# Altium project Documents.PRJPCB
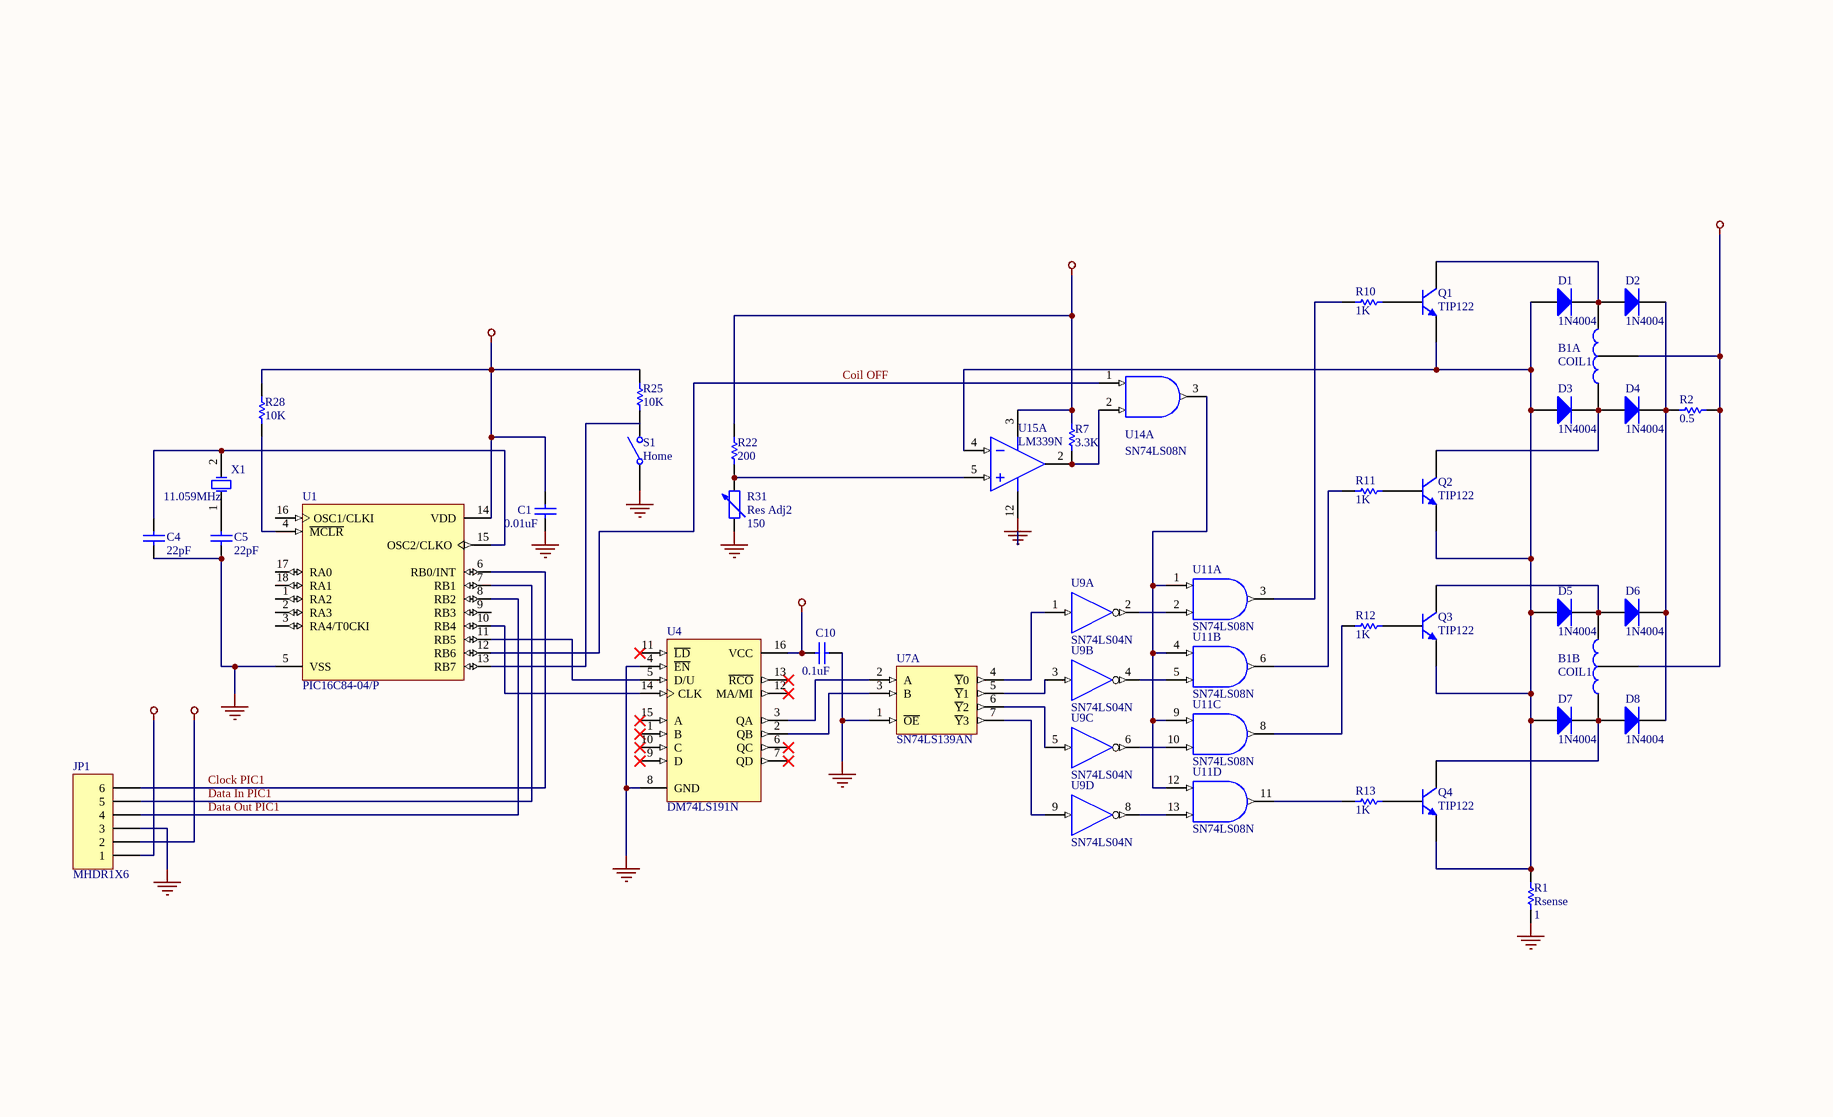
[diagram p0: Sheet1.SchDoc]
4 sheets, 178 parts. Net scope: global (net labels, ports and power ports of the same name join across sheets).
Board files: Board Sensor2.PcbDoc, Board Sensor - extra.PcbDoc, Driver4.PcbDoc, Board Sensor.PcbDoc, Picker.PcbDoc, adua.PcbDoc, Driver2.PcbDoc, Driver3.PcbDoc, Driver5.PcbDoc, main.PCBDOC
Sheets:
  Sheet1.SchDoc
  Driver3.SchDoc
  MAIN.SchDoc
  END EFFECTOR.SchDoc

## Sheet Sheet1.SchDoc: X-AXIS CONTROLLER CIRCUIT
size 342 x 208 mm; DrawnBy: Daniel C. Salunga; SheetNumber: 1

### Parts
(Parts that share a designator on the sheet are numbered #1, #2 ... from top to bottom, then left to right.)
B1A#1  COIL1
B1B#1  COIL1
C1#1  value 0.01uF  [DIP-18]  (hidden comment: PIC16C84-04/P)
C4#1  value 22pF  [BCY-W2/D3.1]  (hidden comment: XTAL)
C5#1  value 22pF  [BCY-W2/D3.1]  (hidden comment: XTAL)
C10#1  value 0.1uF  [DIP-14/D19.7]  (hidden comment: SN74LS08N)
D1#1  1N4004  [DIO10.46-5.3x2.8]
D2#1  1N4004  [DIO10.46-5.3x2.8]
D3#1  1N4004  [DIO10.46-5.3x2.8]
D4#1  1N4004  [DIO10.46-5.3x2.8]
D5#1  1N4004  [DIO10.46-5.3x2.8]
D6#1  1N4004  [DIO10.46-5.3x2.8]
D7#1  1N4004  [DIO10.46-5.3x2.8]
D8#1  1N4004  [DIO10.46-5.3x2.8]
JP1  MHDR1X6  [MHDR1X6]
Q1#1  TIP122  [SFM-T3/X1.6V]
Q2  TIP122  [SFM-T3/X1.6V]
Q3#1  TIP122  [SFM-T3/X1.6V]
Q4#1  TIP122  [SFM-T3/X1.6V]
R1#1  Rsense  value 1  [DIO10.46-5.3x2.8]
R2#1  value 0.5  [DIO10.46-5.3x2.8]  (hidden comment: 1N4004)
R7#1  value 3.3K  [BCY-W3]  (hidden comment: NPN3)
R10#1  1K  [AXIAL-0.3]
R11#1  value 1K  [BCY-W3]  (hidden comment: NPN3)
R12#1  value 1K  [BCY-W3]  (hidden comment: NPN3)
R13#1  value 1K  [BCY-W3]  (hidden comment: NPN3)
R22#1  value 200  [SO-G14/E2]  (hidden comment: DM74LS05M)
R25  value 10K  [SPST-2]  (hidden comment: SW-SPST)
R28#1  value 10K  [DIP-18]  (hidden comment: PIC16C84-04/P)
R31#1  Res Adj2  value 150  [AXIAL-0.6]
S1  Home  [SPST-2]
U1  PIC16C84-04/P  [DIP-18]
U4#1  DM74LS191N  [DIP-16]
U7#1  SN74LS139AN  [DIP-16/X1.5]  (part A of 2)
U9#1  SN74LS04N  [DIP-14/D19.7]  (parts A,B,C,D of 6)
U11#1  SN74LS08N  [DIP-14/D19.7]  (parts A,B,C,D of 4)
U14#1  SN74LS08N  [DIP-14/D19.7]  (part A of 4)
U15#1  LM339N  [DIP-14/D19.7]  (part A of 4)
X1#1  11.059MHz  [BCY-W2/D3.1]

### Nets
+12V: B1A#1.3(Supply) B1B#1.3(Supply) JP1.1 R2#1.2
GND: C1#1.1 C4#1.1 C5#1.1 C10#1.1 JP1.3 R1#1.2 R31#1.1 S1.1(COMMON) U1.5(VSS) U4#1.4(~{EN}) U4#1.8(GND) U7#1.1(~{OE}) U7#1.8(GND) U9#1.7(GND) U11#1.7(GND) U14#1.7(GND) U15#1.12(GND)
VCC: U7#1.16(VCC) U11#1.14(VCC) U14#1.14(VCC)
VDD: C1#1.2 C10#1.2 JP1.2 R7#1.2 R22#1.2 R25.2 R28#1.2 U1.14(VDD) U4#1.16(VCC) U9#1.14(VDD) U15#1.3(V+)
Clock PIC1: JP1.6 U1.6(RB0/INT)
Coil OFF: U1.12(RB6) U14#1.1(A)
Data In PIC1: JP1.5 U1.7(RB1)
Data Out PIC1: JP1.4 U1.8(RB2)
NetB1A#1_1: B1A#1.1 D3#1.2(K) D4#1.1(A) Q2.2(C)
NetB1A#1_2: B1A#1.2 D1#1.2(K) D2#1.1(A) Q1#1.2(C)
NetB1B#1_1: B1B#1.1 D1#1.1(A) D3#1.1(A) D5#1.1(A) D7#1.1(A) D7#1.2(K) D8#1.1(A) Q1#1.3(E) Q2.3(E) Q3#1.3(E) Q4#1.2(C) Q4#1.3(E) R1#1.1 U15#1.4(IN-)
NetB1B#1_2: B1B#1.2 D5#1.2(K) D6#1.1(A) Q3#1.2(C)
NetC4#1_2: C4#1.2 U1.15(OSC2/CLKO) X1#1.2(OSC2)
NetC5#1_2: C5#1.2 X1#1.1(OSC1)
NetD2#1_2: D2#1.2(K) D4#1.2(K) D6#1.2(K) D8#1.2(K) R2#1.1
NetQ1#1_1: Q1#1.1(B) R10#1.2
NetQ2_1: Q2.1(B) R11#1.2
NetQ3#1_1: Q3#1.1(B) R12#1.2
NetQ4#1_1: Q4#1.1(B) R13#1.1
NetR7#1_1: R7#1.1 U14#1.2(B) U15#1.2(OUT)
NetR10#1_1: R10#1.1 U11#1.3(Y)
NetR11#1_1: R11#1.1 U11#1.6(Y)
NetR12#1_1: R12#1.1 U11#1.8(Y)
NetR13#1_2: R13#1.2 U11#1.11(Y)
NetR22#1_1: R22#1.1 R31#1.2 U15#1.5(IN+)
NetR25_1: R25.1 U1.13(RB7)
NetR28#1_1: R28#1.1 U1.4(~{MCLR})
NetU1_10: U1.10(RB4) U4#1.14(CLK)
NetU1_11: U1.11(RB5) U4#1.5(D/U)
NetU4#1_2: U4#1.2(QB) U7#1.3(B)
NetU4#1_3: U4#1.3(QA) U7#1.2(A)
NetU7#1_4: U7#1.4(~{Y}0) U9#1.1(IN)
NetU7#1_5: U7#1.5(~{Y}1) U9#1.3(IN)
NetU7#1_6: U7#1.6(~{Y}2) U9#1.5(IN)
NetU7#1_7: U7#1.7(~{Y}3) U9#1.9(IN)
NetU9#1_2: U9#1.2(~{OUT}) U11#1.2(B)
NetU9#1_4: U9#1.4(~{OUT}) U11#1.5(B)
NetU9#1_6: U9#1.6(~{OUT}) U11#1.10(B)
NetU9#1_8: U9#1.8(~{OUT}) U11#1.13(B)
NetU11#1_1: U11#1.1(A) U11#1.4(A) U11#1.9(A) U11#1.12(A) U14#1.3(Y)

Not connected (* = marked no-connect by the designer): S1 2(NO); U1 1(RA2) 2(RA3) 3(RA4/T0CKI) 9(RB3) 16(OSC1/CLKI) 17(RA0) 18(RA1); U4#1 1(B)* 6(QC)* 7(QD)* 9(D)* 10(C)* 11(~{LD})* 12(MA/MI)* 13(~{RCO})* 15(A)*

### Library data of the parts
B1A#1 B1B#1 = Component_1
C1#1 C4#1 C5#1 C10#1 = cap: Capacitor; Manufacturer: Generic Components; Class I: Passive; Published: 8-Jun-2000; Revision: July-2002: Re-released for DXP Platform.; Publisher: Altium Limited; Class II: Capacitor
D1#1 D2#1 D3#1 D4#1 D5#1 D6#1 D7#1 D8#1 = 1N4004: 1.0 Ampere General Purpose Rectifier; Manufacturer: Fairchild Semiconductor; Revision 1: 11-July-2000: SIM Model Added.; Revision 2: July-2002: Re-released for DXP Platform.; Package Information: Latest Revision: Aug-1999; Class I: Discrete; Class II: Rectifier - Standard Recovery; Published: 8-Jun-2000; Datasheet: Latest Revision: 1998; Package Reference: DO-41; Publisher: Altium Limited
JP1 = MHDR1X6: Header, 6-Pin; Manufacturer: Generic Components; Class I: Connector; Revision: July-2002: Re-released for DXP Platform.; Publisher: Altium Limited
Q1#1 Q2 Q3#1 Q4#1 = MJE15030: Complementary Silicon Plastic Power Transistor; Manufacturer: Motorola; Package Information: Latest Revision: 1997; Class I: Discrete; Class II: BJT - Medium Power; Note: Pin 2 is electrically connected to Pin 4 (TAB); Published: 29-Sep-2000; Revision: July-2002: Re-released for DXP Platform.; Datasheet: Latest Revision: 1995; Package Reference: 221A-06; Publisher: Altium Limited
R1#1 R2#1 R7#1 R11#1 R12#1 R13#1 R22#1 R25 R28#1 = res1: Resistor; Manufacturer: Generic Components; Class I: Passive; Published: 8-Jun-2000; Revision: July-2002: Re-released for DXP Platform.; Publisher: Altium Limited; Class II: Resistor
R10#1 = Res1: Resistor; Manufacturer: Generic Components; Class I: Passive; Published: 8-Jun-2000; Publisher: Altium Limited; Class II: Resistor; Revision: July-2002: Re-released for DXP Platform.; Value: 1K
R31#1 = Res Adj2: Variable Resistor; Manufacturer: Generic Components; Class I: Passive; Set Position: 0.5; Published: 8-Jun-2000; Revision: July-2002: Re-released for DXP Platform.; Publisher: Altium Limited; Class II: Resistor
S1 = SW-SPST: Single-Pole, Single-Throw Switch; Manufacturer: Generic Components; Published: 24-Mar-1999; Revision: July-2002: Re-released for DXP Platform.; Publisher: Altium Limited
U1 = PIC16C84-04/P: EPROM-Based 8-Bit CMOS Microcontroller; Manufacturer: Microchip; Published: 8-Jun-2000; Revision: July-2002: Re-released for DXP Platform.; Datasheet: 1997 Technical Library CD (1996); Package Reference: P18A; Publisher: Altium Limited; Class I: Microcontroller; Class II: 8-bit
U4#1 = DM74LS191N: Synchronous 4-Bit Up/Down Counter with Mode Control; Manufacturer: National Semiconductor; Class I: Logic; Published: 15-Apr-2002; Datasheet: Latest Revision: May-1989; Package Reference: N16E; Publisher: Altium Limited; Class II: Counter
U7#1 = SN74LS139AN: Dual 2-Line to 4-Line Decoder / Demultiplexer; Manufacturer: Texas Instruments; Revision 1: 12-July-2000: SIM Model Added.; Revision 2: July-2002: Re-released for DXP Platform.; Class I: Logic; Published: 8-Jun-2000; Datasheet: Latest Revision: Mar-1988; Package Reference: N016; Publisher: Altium Limited; Class II: Decoder/Demultiplexer
U9#1 = SN74LS04N: Hex Inverter; Manufacturer: ON Semiconductor; Class I: Logic; Class II: Buffer/Line Driver; Published: 15-Apr-2002; Datasheet: Latest Revision: 1999; Package Reference: 646-06; Publisher: Altium Limited
U11#1 U14#1 = SN74LS08N: Quadruple 2-Input Positive-AND Gate; Manufacturer: Texas Instruments; Class I: Logic; Published: 8-Jun-2000; Revision: July-2002: Re-released for DXP Platform.; Datasheet: Latest Revision: Mar-1988; Package Reference: N014; Publisher: Altium Limited; Class II: Gate
U15#1 = LM339N: Quad Single-Supply Comparator; Manufacturer: Motorola; Class I: Analog; Published: 15-Apr-2002; Datasheet: Linear and Interface Integrated Circuits, DL128 Rev2 (1988); Package Reference: 646-06; Publisher: Altium Limited; Class II: Comparator
X1#1 = XTAL: Crystal Oscillator; Manufacturer: Generic Components; Published: 8-Jun-2000; Revision: July-2002: Re-released for DXP Platform.; Publisher: Altium Limited; Class I: Oscillator; Class II: Crystal Oscillator

## Sheet Driver3.SchDoc
size B
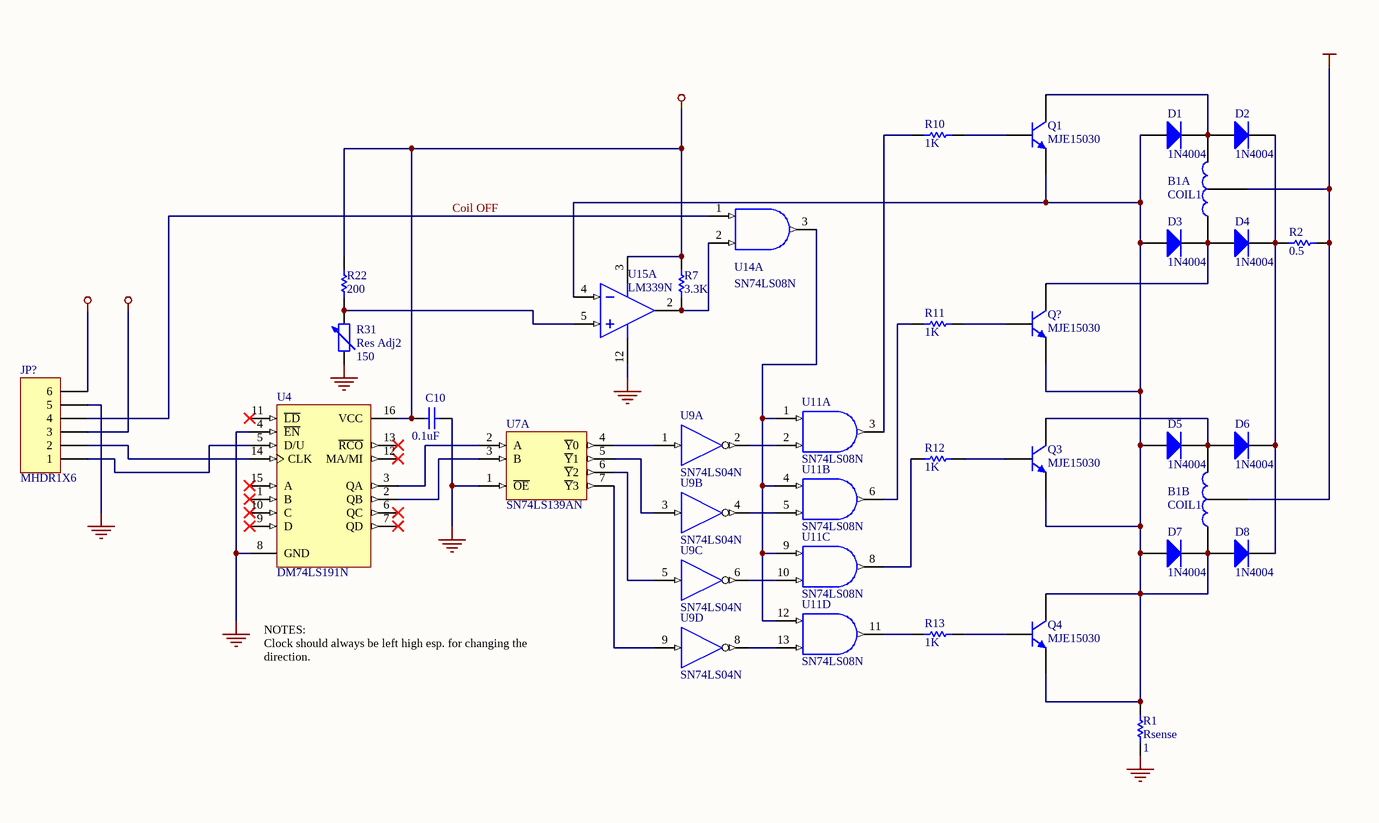
[diagram p1: Driver3.SchDoc]

### Parts
(Parts that share a designator on the sheet are numbered #1, #2 ... from top to bottom, then left to right.)
B1A#2  COIL1
B1B#2  COIL1
C10#2  value 0.1uF  [DIP-14/D19.7]  (hidden comment: SN74LS08N)
D1#2  1N4004  [DIO10.46-5.3x2.8]
D2#2  1N4004  [DIO10.46-5.3x2.8]
D3#2  1N4004  [DIO10.46-5.3x2.8]
D4#2  1N4004  [DIO10.46-5.3x2.8]
D5#2  1N4004  [DIO10.46-5.3x2.8]
D6#2  1N4004  [DIO10.46-5.3x2.8]
D7#2  1N4004  [DIO10.46-5.3x2.8]
D8#2  1N4004  [DIO10.46-5.3x2.8]
JP?#1  MHDR1X6  [MHDR1X6]
Q1#2  MJE15030  [SFM-T3/X1.6V]
Q3#2  MJE15030  [SFM-T3/X1.6V]
Q4#2  MJE15030  [SFM-T3/X1.6V]
Q?#1  MJE15030  [SFM-T3/X1.6V]
R1#2  Rsense  value 1  [DIO10.46-5.3x2.8]
R2#2  value 0.5  [DIO10.46-5.3x2.8]  (hidden comment: 1N4004)
R7#2  value 3.3K  [BCY-W3]  (hidden comment: NPN3)
R10#2  1K  [AXIAL-0.3]
R11#2  value 1K  [BCY-W3]  (hidden comment: NPN3)
R12#2  value 1K  [BCY-W3]  (hidden comment: NPN3)
R13#2  value 1K  [BCY-W3]  (hidden comment: NPN3)
R22#2  value 200  [SO-G14/E2]  (hidden comment: DM74LS05M)
R31#2  Res Adj2  value 150  [AXIAL-0.6]
U4#2  DM74LS191N  [DIP-16]
U7#2  SN74LS139AN  [DIP-16/X1.5]  (part A of 2)
U9#2  SN74LS04N  [DIP-14/D19.7]  (parts A,B,C,D of 6)
U11#2  SN74LS08N  [DIP-14/D19.7]  (parts A,B,C,D of 4)
U14#2  SN74LS08N  [DIP-14/D19.7]  (part A of 4)
U15#2  LM339N  [DIP-14/D19.7]  (part A of 4)

### Nets
+12V: B1A#2.3(Supply) B1B#2.3(Supply) JP?#1.6 R2#2.2
GND: C10#2.1 JP?#1.5 R1#2.2 R31#2.1 U4#2.4(~{EN}) U4#2.8(GND) U7#2.1(~{OE}) U7#2.8(GND) U9#2.7(GND) U11#2.7(GND) U14#2.7(GND) U15#2.12(GND)
VCC: U7#2.16(VCC) U11#2.14(VCC) U14#2.14(VCC)
VDD: C10#2.2 JP?#1.3 R7#2.2 R22#2.2 U4#2.16(VCC) U9#2.14(VDD) U15#2.3(V+)
Coil OFF: JP?#1.4 U14#2.1(A)
NetB1A#2_1: B1A#2.1 D3#2.2(K) D4#2.1(A) Q?#1.2(C)
NetB1A#2_2: B1A#2.2 D1#2.2(K) D2#2.1(A) Q1#2.2(C)
NetB1B#2_1: B1B#2.1 D1#2.1(A) D3#2.1(A) D5#2.1(A) D7#2.1(A) D7#2.2(K) D8#2.1(A) Q1#2.3(E) Q3#2.3(E) Q4#2.2(C) Q4#2.3(E) Q?#1.3(E) R1#2.1 U15#2.4(IN-)
NetB1B#2_2: B1B#2.2 D5#2.2(K) D6#2.1(A) Q3#2.2(C)
NetD2#2_2: D2#2.2(K) D4#2.2(K) D6#2.2(K) D8#2.2(K) R2#2.1
NetJP?#1_1: JP?#1.1 U4#2.5(D/U)
NetJP?#1_2: JP?#1.2 U4#2.14(CLK)
NetQ1#2_1: Q1#2.1(B) R10#2.2
NetQ3#2_1: Q3#2.1(B) R12#2.2
NetQ4#2_1: Q4#2.1(B) R13#2.1
NetQ?#1_1: Q?#1.1(B) R11#2.2
NetR7#2_1: R7#2.1 U14#2.2(B) U15#2.2(OUT)
NetR10#2_1: R10#2.1 U11#2.3(Y)
NetR11#2_1: R11#2.1 U11#2.6(Y)
NetR12#2_1: R12#2.1 U11#2.8(Y)
NetR13#2_2: R13#2.2 U11#2.11(Y)
NetR22#2_1: R22#2.1 R31#2.2 U15#2.5(IN+)
NetU4#2_2: U4#2.2(QB) U7#2.3(B)
NetU4#2_3: U4#2.3(QA) U7#2.2(A)
NetU7#2_4: U7#2.4(~{Y}0) U9#2.1(IN)
NetU7#2_5: U7#2.5(~{Y}1) U9#2.3(IN)
NetU7#2_6: U7#2.6(~{Y}2) U9#2.5(IN)
NetU7#2_7: U7#2.7(~{Y}3) U9#2.9(IN)
NetU9#2_2: U9#2.2(~{OUT}) U11#2.2(B)
NetU9#2_4: U9#2.4(~{OUT}) U11#2.5(B)
NetU9#2_6: U9#2.6(~{OUT}) U11#2.10(B)
NetU9#2_8: U9#2.8(~{OUT}) U11#2.13(B)
NetU11#2_1: U11#2.1(A) U11#2.4(A) U11#2.9(A) U11#2.12(A) U14#2.3(Y)

Not connected (* = marked no-connect by the designer): U4#2 1(B)* 6(QC)* 7(QD)* 9(D)* 10(C)* 11(~{LD})* 12(MA/MI)* 13(~{RCO})* 15(A)*

### Notes on the sheet
- NOTES:
  Clock should always be left high esp. for changing the direction.

### Library data of the parts
B1A#2 B1B#2 = Component_1
C10#2 = cap: as C1#1 on sheet Sheet1; Published: 8-Jun-2000; Revision: July-2002: Re-released for DXP Platform.; Publisher: Altium Limited; Class II: Capacitor
D1#2 D2#2 D3#2 D4#2 D5#2 D6#2 D7#2 D8#2 = 1N4004: as D1#1 on sheet Sheet1; Published: 8-Jun-2000; Datasheet: Latest Revision: 1998; Package Reference: DO-41; Publisher: Altium Limited
JP?#1 = MHDR1X6: as JP1 on sheet Sheet1; Revision: July-2002: Re-released for DXP Platform.; Publisher: Altium Limited
Q1#2 Q3#2 Q4#2 Q?#1 = MJE15030: as Q1#1 on sheet Sheet1; Published: 29-Sep-2000; Revision: July-2002: Re-released for DXP Platform.; Datasheet: Latest Revision: 1995; Package Reference: 221A-06; Publisher: Altium Limited
R1#2 R2#2 R7#2 R11#2 R12#2 R13#2 R22#2 = res1: as R1#1 on sheet Sheet1; Published: 8-Jun-2000; Revision: July-2002: Re-released for DXP Platform.; Publisher: Altium Limited; Class II: Resistor
R10#2 = Res1: as R10#1 on sheet Sheet1; Published: 8-Jun-2000; Publisher: Altium Limited; Class II: Resistor; Revision: July-2002: Re-released for DXP Platform.; Value: 1K
R31#2 = Res Adj2: as R31#1 on sheet Sheet1; Published: 8-Jun-2000; Revision: July-2002: Re-released for DXP Platform.; Publisher: Altium Limited; Class II: Resistor
U4#2 = DM74LS191N: as U4#1 on sheet Sheet1; Published: 15-Apr-2002; Datasheet: Latest Revision: May-1989; Package Reference: N16E; Publisher: Altium Limited; Class II: Counter
U7#2 = SN74LS139AN: as U7#1 on sheet Sheet1; Published: 8-Jun-2000; Datasheet: Latest Revision: Mar-1988; Package Reference: N016; Publisher: Altium Limited; Class II: Decoder/Demultiplexer
U9#2 = SN74LS04N: as U9#1 on sheet Sheet1; Published: 15-Apr-2002; Datasheet: Latest Revision: 1999; Package Reference: 646-06; Publisher: Altium Limited
U11#2 U14#2 = SN74LS08N: as U11#1 on sheet Sheet1; Published: 8-Jun-2000; Revision: July-2002: Re-released for DXP Platform.; Datasheet: Latest Revision: Mar-1988; Package Reference: N014; Publisher: Altium Limited; Class II: Gate
U15#2 = LM339N: as U15#1 on sheet Sheet1; Published: 15-Apr-2002; Datasheet: Linear and Interface Integrated Circuits, DL128 Rev2 (1988); Package Reference: 646-06; Publisher: Altium Limited; Class II: Comparator

## Sheet MAIN.SchDoc
size OrCAD C
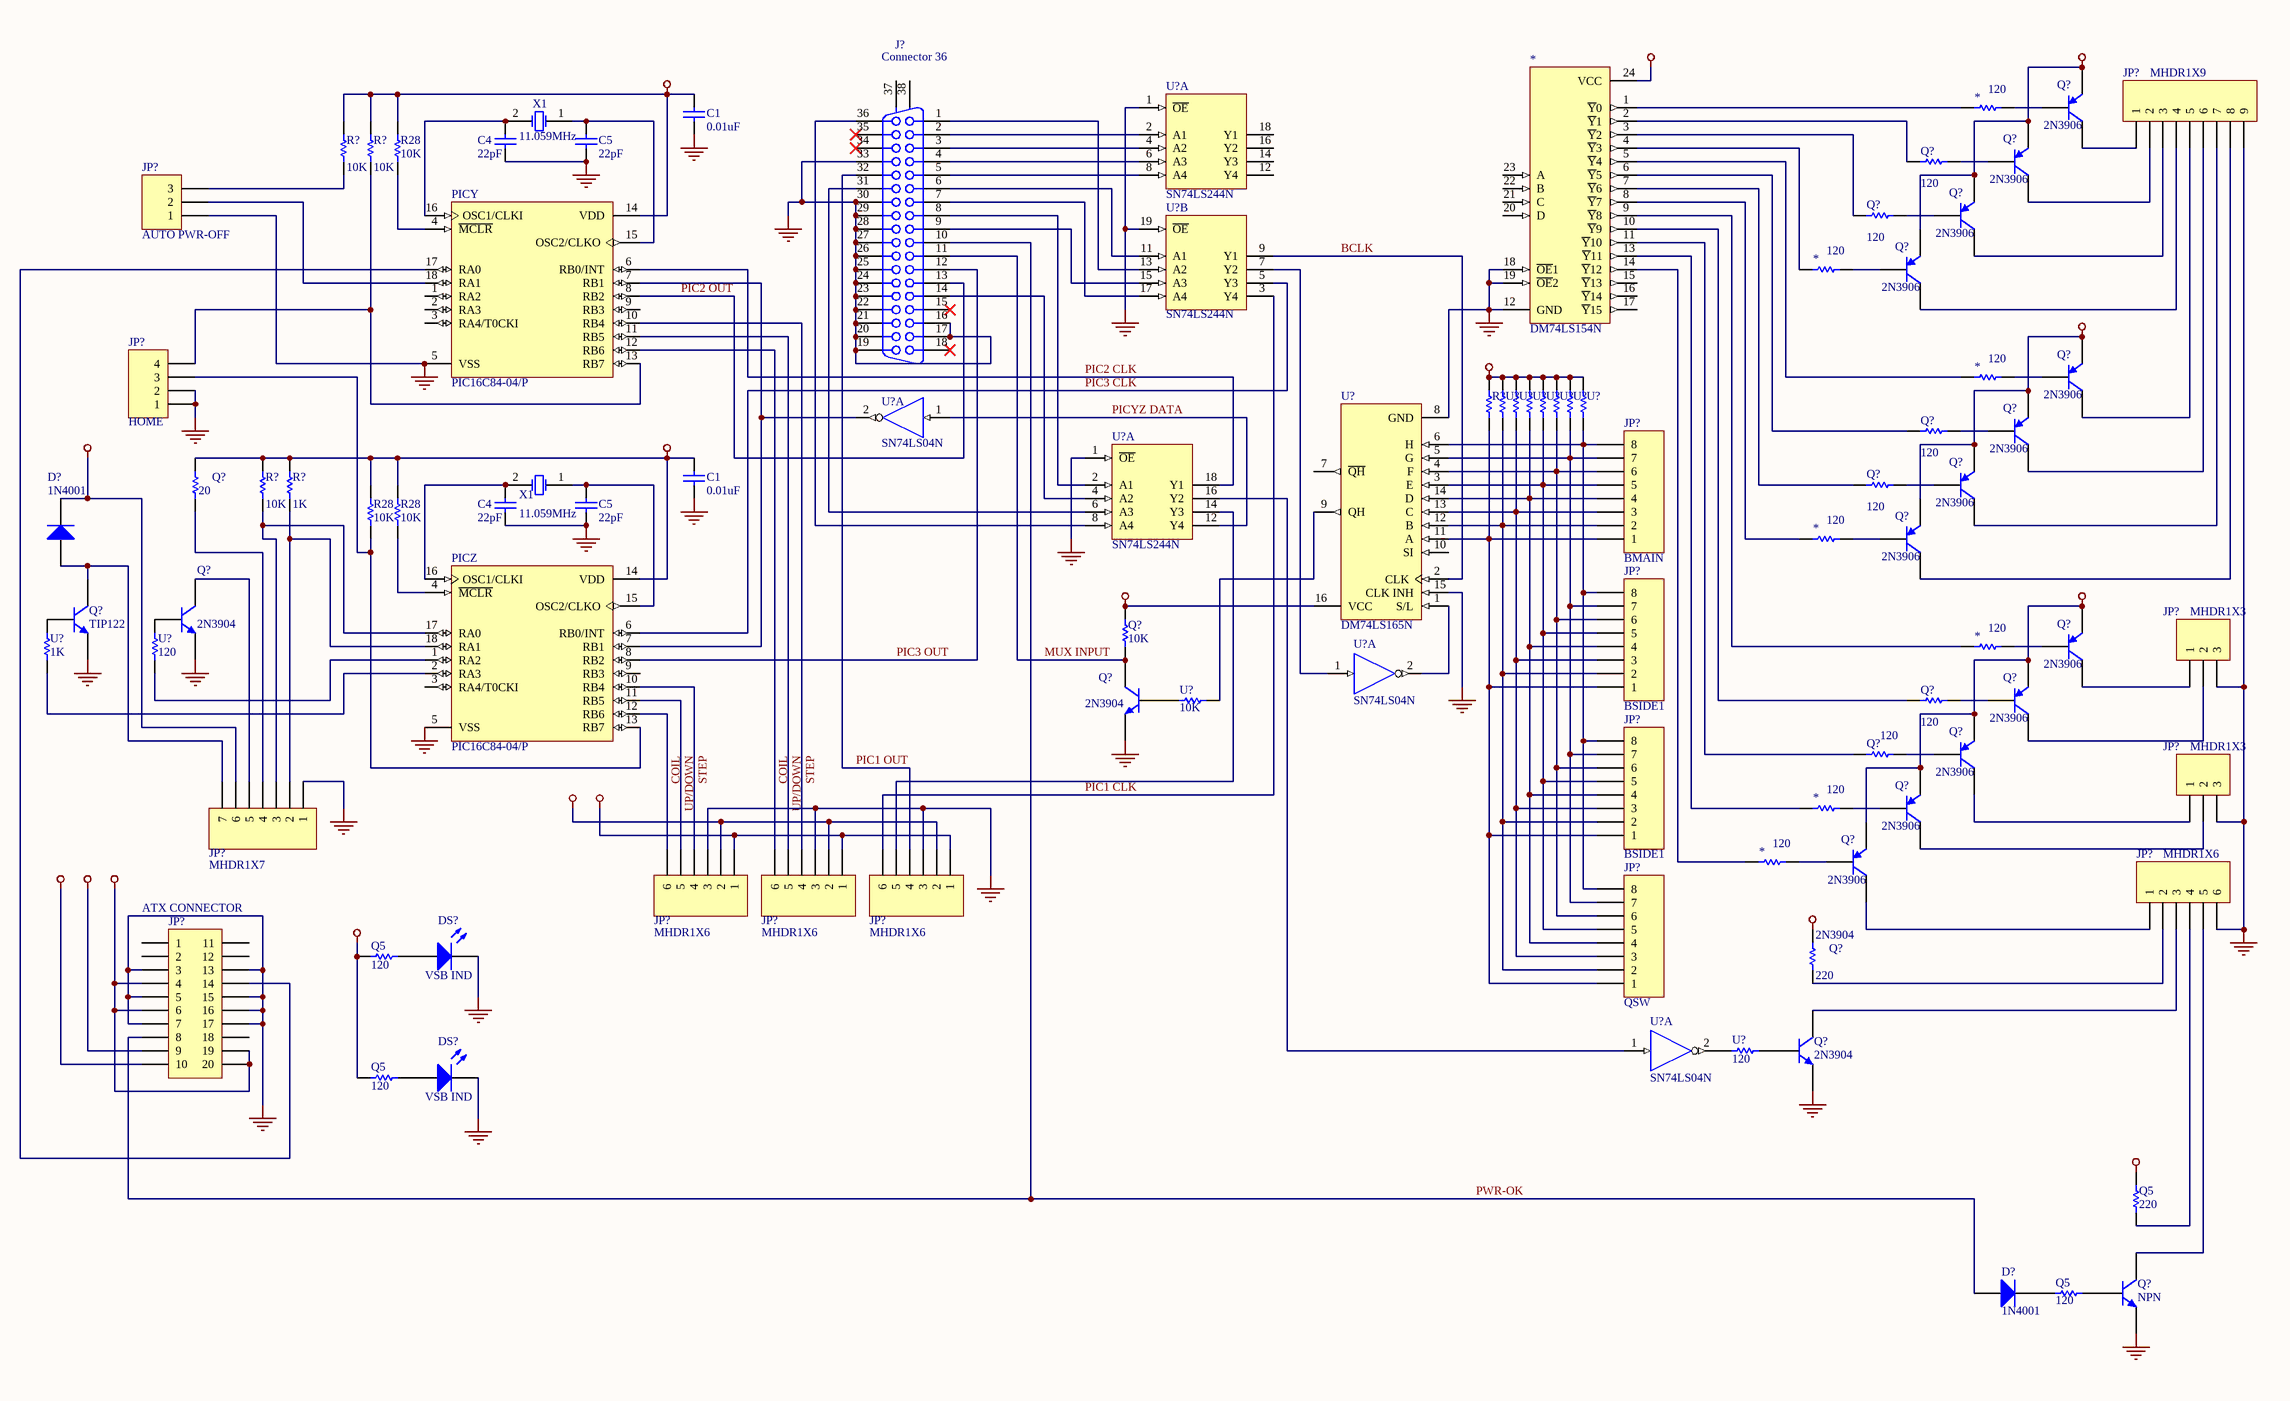
[diagram p2: MAIN.SchDoc]

### Parts
(Parts that share a designator on the sheet are numbered #1, #2 ... from top to bottom, then left to right.)
*#1  DM74LS154N  [DIP-16/X1.5]
*#2  value 120  [DIP-16/X1.5]  (hidden comment: SN74LS161AN)
*#3  value 120  [DIP-16/X1.5]  (hidden comment: SN74LS161AN)
*#4  value 120  [DIP-16/X1.5]  (hidden comment: SN74LS161AN)
*#5  value 120  [DIP-16/X1.5]  (hidden comment: SN74LS161AN)
*#6  value 120  [DIP-16/X1.5]  (hidden comment: SN74LS161AN)
*#7  value 120  [DIP-16/X1.5]  (hidden comment: SN74LS161AN)
*#8  value 120  [DIP-16/X1.5]  (hidden comment: SN74LS161AN)
C1#2  value 0.01uF  [RAD-0.3]
C1#3  value 0.01uF  [RAD-0.3]
C4#2  value 22pF  [C3216-1206]  (hidden comment: XTAL)
C4#3  value 22pF  [C3216-1206]  (hidden comment: XTAL)
C5#2  value 22pF  [C3216-1206]  (hidden comment: XTAL)
C5#3  value 22pF  [C3216-1206]  (hidden comment: XTAL)
D?#1  1N4001  [DIO10.46-5.3x2.8]
D?#2  1N4001  [DIO10.46-5.3x2.8]
DS?#1  VSB IND  [DSO-F2/D6.1]
DS?#2  VSB IND  [DSO-F2/D6.1]
J?  Connector 36  [CHAMP1.27-2H36]
JP?#2  MHDR1X9  [MHDR1X9]
JP?#3  AUTO PWR-OFF  [HDR1X3H]
JP?#4  HOME  [MHDR1X4]
JP?#5  BMAIN  [MHDR1X8]
JP?#6  MHDR1X3  [MHDR1X3]
JP?#7  BSIDE1  [MHDR1X8]
JP?#8  MHDR1X3  [MHDR1X3]
JP?#9  MHDR1X7  [MHDR1X7]
JP?#10  BSIDE1  [MHDR1X8]
JP?#11  MHDR1X6  [MHDR1X6]
JP?#12  MHDR1X6  [MHDR1X6]
JP?#13  MHDR1X6  [MHDR1X6]
JP?#14  MHDR1X6  [MHDR1X6]
JP?#15  ATX CONNECTOR  [HDR2X10_CEN]
JP?#16  QSW  [MHDR1X8]
PICY  PIC16C84-04/P  [DIP-18]
PICZ  PIC16C84-04/P  [DIP-18]
Q5#1  value 120  [SFM-T3/X1.6V]  (hidden comment: MJE15030)
Q5#2  value 120  [SFM-T3/X1.6V]  (hidden comment: MJE15030)
Q5#3  value 220  [SFM-T3/X1.6V]  (hidden comment: MJE15030)
Q5#4  value 120  [SFM-T3/X1.6V]  (hidden comment: MJE15030)
Q?#2  2N3906  [BCY-W3/D4.7]
Q?#3  value 120  [BCY-W3/D4.7]  (hidden comment: 2N3906)
Q?#4  2N3906  [BCY-W3/D4.7]
Q?#5  value 120  [BCY-W3/D4.7]  (hidden comment: 2N3906)
Q?#6  2N3906  [BCY-W3/D4.7]
Q?#7  2N3906  [BCY-W3/D4.7]
Q?#8  2N3906  [BCY-W3/D4.7]
Q?#9  value 120  [BCY-W3/D4.7]  (hidden comment: 2N3906)
Q?#10  2N3906  [BCY-W3/D4.7]
Q?#11  value 120  [BCY-W3/D4.7]  (hidden comment: 2N3906)
Q?#12  2N3906  [BCY-W3/D4.7]
Q?#13  value 20  [BCY-W3/D4.7]  (hidden comment: 2N3904)
Q?#14  2N3906  [BCY-W3/D4.7]
Q?#15  TIP122  [SFM-T3/X1.6V]
Q?#16  2N3904  [BCY-W3/D4.7]
Q?#17  2N3906  [BCY-W3/D4.7]
Q?#18  value 10K  [BCY-W3/D4.7]  (hidden comment: 2N3904)
Q?#19  2N3904  [BCY-W3/D4.7]
Q?#20  value 120  [BCY-W3/D4.7]  (hidden comment: 2N3906)
Q?#21  2N3906  [BCY-W3/D4.7]
Q?#22  value 120  [BCY-W3/D4.7]  (hidden comment: 2N3906)
Q?#23  2N3906  [BCY-W3/D4.7]
Q?#24  2N3906  [BCY-W3/D4.7]
Q?#25  2N3906  [BCY-W3/D4.7]
Q?#26  2N3904  value 220  [BCY-W3/D4.7]
Q?#27  2N3904  [BCY-W3/D4.7]
Q?#28  NPN  [BCY-W3]
R28#2  value 10K  [DIP-18]  (hidden comment: PIC16C84-04/P)
R28#3  value 10K  [DIP-18]  (hidden comment: PIC16C84-04/P)
R28#4  value 10K  [DIP-18]  (hidden comment: PIC16C84-04/P)
R?#1  value 10K  [AXIAL-0.7]  (hidden comment: Res Adj1)
R?#2  value 10K  [AXIAL-0.7]  (hidden comment: Res Adj1)
R?#3  10K  [SIP-P3]  (value not drawn)
R?#4  value 1K  [AXIAL-0.7]  (hidden comment: Res Adj1)
R?#5  value 10K  [AXIAL-0.7]  (hidden comment: Res Adj1)
U?#1  SN74LS244N  [DIP-20/E5.3]  (part A of 2)
U?#2  SN74LS244N  [DIP-20/E5.3]  (part B of 2)
U?#3  A3189SU  [SIP-P3]  (value not drawn)
U?#4  A3189SU  [SIP-P3]  (value not drawn)
U?#5  A3189SU  [SIP-P3]  (value not drawn)
U?#6  A3189SU  [SIP-P3]  (value not drawn)
U?#7  A3189SU  [SIP-P3]  (value not drawn)
U?#8  A3189SU  [SIP-P3]  (value not drawn)
U?#9  A3189SU  [SIP-P3]  (value not drawn)
U?#10  SN74LS04N  [DIP-14/D19.7]  (part A of 6)
U?#11  SN74LS244N  [DIP-20/E5.3]  (part A of 2)
U?#12  DM74LS165N  [CDFP-G16/E7]
U?#13  SN74LS04N  [DIP-14/D19.7]  (part A of 6)
U?#14  value 1K  [DIP-14/D19.7]  (hidden comment: SN74LS04N)
U?#15  value 120  [DIP-14/D19.7]  (hidden comment: SN74LS04N)
U?#16  value 10K  [CDFP-G16/E7]  (hidden comment: DM74LS165N)
U?#17  SN74LS04N  [DIP-14/D19.7]  (part A of 6)
U?#18  value 120  [DIP-14/D19.7]  (hidden comment: SN74LS04N)
X1#2  11.059MHz  [BCY-W2/D3.1]
X1#3  11.059MHz  [BCY-W2/D3.1]

### Nets
+12V: D?#1.2(K) JP?#9.6 JP?#11.1 JP?#12.1 JP?#13.1 JP?#15.10
GND: *#1.12(GND) *#1.18(~{OE}1) *#1.19(~{OE}2) C1#2.2 C1#3.2 C4#2.1 C4#3.1 C5#2.1 C5#3.1 DS?#1.2(K) DS?#2.2(K) J?.16 J?.17 J?.19 J?.20 J?.21 J?.22 J?.23 J?.24 J?.25 J?.26 J?.27 J?.28 J?.29 J?.30 J?.33 JP?#2.9 JP?#3.1 JP?#4.1 JP?#4.2 JP?#6.3 JP?#8.3 JP?#9.1 JP?#11.3 JP?#12.3 JP?#13.3 JP?#14.6 JP?#15.3 JP?#15.5 JP?#15.7 JP?#15.13 JP?#15.15 JP?#15.16 JP?#15.17 PICY.5(VSS) PICZ.5(VSS) Q?#15.3(E) Q?#16.1(E) Q?#19.1(E) Q?#27.1(E) Q?#28.3(E) U?#1.1(~{OE}) U?#1.10(GND) U?#2.10(GND) U?#2.19(~{OE}) U?#10.7(GND) U?#11.1(~{OE}) U?#11.10(GND) U?#12.8(GND) U?#12.15(CLK_INH) U?#13.7(GND) U?#17.7(GND)
VDD: *#1.24(VCC) C1#3.1 JP?#11.2 JP?#12.2 JP?#13.2 JP?#15.4 JP?#15.6 JP?#15.19 JP?#15.20 PICZ.14(VDD) Q?#2.1(E) Q?#4.1(E) Q?#6.1(E) Q?#7.1(E) Q?#8.1(E) Q?#10.1(E) Q?#12.1(E) Q?#13.2 Q?#14.1(E) Q?#17.1(E) Q?#18.2 Q?#21.1(E) Q?#23.1(E) Q?#24.1(E) Q?#25.1(E) Q?#26.2 R28#3.2 R28#4.2 R?#3.2 R?#4.1 R?#5.2 U?#1.20(VDD) U?#2.20(VDD) U?#3.2 U?#4.2 U?#5.2 U?#6.2 U?#7.2 U?#8.2 U?#9.2 U?#10.14(VDD) U?#11.20(VDD) U?#12.16(VCC) U?#13.14(VDD) U?#17.14(VDD)
VSB: C1#2.1 JP?#15.9 PICY.14(VDD) Q5#1.1 Q5#2.1 Q5#3.1 R28#2.2 R?#1.1 R?#2.1
BCLK: U?#2.9(Y1) U?#12.2(CLK)
COIL: JP?#11.6 JP?#12.6 PICY.12(RB6) PICZ.12(RB6)
MUX INPUT: J?.11 Q?#18.1 Q?#19.3(C)
PIC1 CLK: JP?#13.6 U?#2.3(Y4)
PIC1 OUT: J?.32 JP?#13.4
PIC2 CLK: PICY.6(RB0/INT) U?#11.18(Y1)
PIC2 OUT: J?.13 PICY.8(RB2)
PIC3 CLK: PICZ.6(RB0/INT) U?#2.5(Y3)
PIC3 OUT: J?.12 PICZ.8(RB2)
PICYZ DATA: U?#10.1(IN) U?#11.12(Y4)
PWR-OK: D?#2.1(A) J?.10 JP?#15.8
STEP: JP?#11.4 JP?#12.4 PICY.10(RB4) PICZ.10(RB4)
UP/DOWN: JP?#11.5 JP?#12.5 PICY.11(RB5) PICZ.11(RB5)
Net*#1_1: *#1.1(~{Y}0) *#2.1
Net*#1_2: *#1.2(~{Y}1) Q?#3.1
Net*#1_3: *#1.3(~{Y}2) Q?#5.1
Net*#1_4: *#1.4(~{Y}3) *#3.1
Net*#1_5: *#1.5(~{Y}4) *#4.1
Net*#1_6: *#1.6(~{Y}5) Q?#9.1
Net*#1_7: *#1.7(~{Y}6) Q?#11.1
Net*#1_8: *#1.8(~{Y}7) *#5.1
Net*#1_9: *#1.9(~{Y}8) *#6.1
Net*#1_10: *#1.10(~{Y}9) Q?#20.1
Net*#1_11: *#1.11(~{Y}10) Q?#22.1
Net*#1_13: *#1.13(~{Y}11) *#7.1
Net*#1_14: *#1.14(~{Y}12) *#8.1
Net*#2_2: *#2.2 Q?#2.2(B)
Net*#3_2: *#3.2 Q?#7.2(B)
Net*#4_2: *#4.2 Q?#8.2(B)
Net*#5_2: *#5.2 Q?#14.2(B)
Net*#6_2: *#6.2 Q?#17.2(B)
Net*#7_2: *#7.2 Q?#24.2(B)
Net*#8_2: *#8.2 Q?#25.2(B)
NetC4#2_2: C4#2.2 PICY.16(OSC1/CLKI) X1#2.2(OSC2)
NetC4#3_2: C4#3.2 PICZ.16(OSC1/CLKI) X1#3.2(OSC2)
NetC5#2_2: C5#2.2 PICY.15(OSC2/CLKO) X1#2.1(OSC1)
NetC5#3_2: C5#3.2 PICZ.15(OSC2/CLKO) X1#3.1(OSC1)
NetD?#1_1: D?#1.1(A) JP?#9.7 Q?#15.2(C)
NetD?#2_2: D?#2.2(K) Q5#4.1
NetDS?#1_1: DS?#1.1(A) Q5#1.2
NetDS?#2_1: DS?#2.1(A) Q5#2.2
NetJ?_1: J?.1 U?#2.13(A2)
NetJ?_2: J?.2 U?#1.2(A1)
NetJ?_3: J?.3 U?#1.4(A2)
NetJ?_4: J?.4 U?#1.6(A3)
NetJ?_5: J?.5 U?#1.8(A4)
NetJ?_6: J?.6 U?#2.11(A1)
NetJ?_7: J?.7 U?#2.17(A4)
NetJ?_8: J?.8 U?#11.2(A1)
NetJ?_9: J?.9 U?#2.15(A3)
NetJ?_14: J?.14 U?#11.4(A2)
NetJ?_31: J?.31 U?#11.6(A3)
NetJ?_36: J?.36 U?#11.8(A4)
NetJP?#2_1: JP?#2.1 Q?#2.3(C)
NetJP?#2_2: JP?#2.2 Q?#4.3(C)
NetJP?#2_3: JP?#2.3 Q?#6.3(C)
NetJP?#2_4: JP?#2.4 Q?#7.3(C)
NetJP?#2_5: JP?#2.5 Q?#8.3(C)
NetJP?#2_6: JP?#2.6 Q?#10.3(C)
NetJP?#2_7: JP?#2.7 Q?#12.3(C)
NetJP?#2_8: JP?#2.8 Q?#14.3(C)
NetJP?#3_2: JP?#3.2 PICY.18(RA1)
NetJP?#3_3: JP?#3.3 R?#1.2
NetJP?#4_3: JP?#4.3 PICZ.13(RB7) R28#3.1
NetJP?#4_4: JP?#4.4 PICY.13(RB7) R?#2.2
NetJP?#5_1: JP?#5.1 JP?#7.1 JP?#10.1 JP?#16.1 R?#3.1 U?#12.11(A)
NetJP?#5_2: JP?#5.2 JP?#7.2 JP?#10.2 JP?#16.2 U?#3.1 U?#12.12(B)
NetJP?#5_3: JP?#5.3 JP?#7.3 JP?#10.3 JP?#16.3 U?#4.1 U?#12.13(C)
NetJP?#5_4: JP?#5.4 JP?#7.4 JP?#10.4 JP?#16.4 U?#5.1 U?#12.14(D)
NetJP?#5_5: JP?#5.5 JP?#7.5 JP?#10.5 JP?#16.5 U?#6.1 U?#12.3(E)
NetJP?#5_6: JP?#5.6 JP?#7.6 JP?#10.6 JP?#16.6 U?#7.1 U?#12.4(F)
NetJP?#5_7: JP?#5.7 JP?#7.7 JP?#10.7 JP?#16.7 U?#8.1 U?#12.5(G)
NetJP?#5_8: JP?#5.8 JP?#7.8 JP?#10.8 JP?#16.8 U?#9.1 U?#12.6(H)
NetJP?#6_1: JP?#6.1 Q?#17.3(C)
NetJP?#6_2: JP?#6.2 Q?#21.3(C)
NetJP?#8_1: JP?#8.1 Q?#23.3(C)
NetJP?#8_2: JP?#8.2 Q?#24.3(C)
NetJP?#9_2: JP?#9.2 PICZ.18(RA1) R?#4.2
NetJP?#9_3: JP?#9.3 PICZ.17(RA0) R?#5.1
NetJP?#9_4: JP?#9.4 Q?#13.1
NetJP?#9_5: JP?#9.5 Q?#16.3(C)
NetJP?#13_5: JP?#13.5 U?#11.14(Y3)
NetJP?#14_1: JP?#14.1 Q?#25.3(C)
NetJP?#14_2: JP?#14.2 Q?#26.1
NetJP?#14_3: JP?#14.3 Q?#27.3(C)
NetJP?#14_4: JP?#14.4 Q5#3.2
NetJP?#14_5: JP?#14.5 Q?#28.1(C)
NetJP?#15_14: JP?#15.14 PICY.17(RA0)
NetPICY_4: PICY.4(~{MCLR}) R28#2.1
NetPICY_7: PICY.7(RB1) PICZ.7(RB1) U?#10.2(~{OUT})
NetPICZ_1: PICZ.1(RA2) U?#15.1
NetPICZ_2: PICZ.2(RA3) U?#14.1
NetPICZ_4: PICZ.4(~{MCLR}) R28#4.1
NetQ5#4_2: Q5#4.2 Q?#28.2(B)
NetQ?#3_2: Q?#3.2 Q?#4.2(B)
NetQ?#5_2: Q?#5.2 Q?#6.2(B)
NetQ?#9_2: Q?#9.2 Q?#10.2(B)
NetQ?#11_2: Q?#11.2 Q?#12.2(B)
NetQ?#15_1: Q?#15.1(B) U?#14.2
NetQ?#16_2: Q?#16.2(B) U?#15.2
NetQ?#19_2: Q?#19.2(B) U?#16.1
NetQ?#20_2: Q?#20.2 Q?#21.2(B)
NetQ?#22_2: Q?#22.2 Q?#23.2(B)
NetQ?#27_2: Q?#27.2(B) U?#18.2
NetU?#2_7: U?#2.7(Y2) U?#13.1(IN)
NetU?#11_16: U?#11.16(Y2) U?#17.1(IN)
NetU?#12_1: U?#12.1(S/L) U?#13.2(~{OUT})
NetU?#12_9: U?#12.9(QH) U?#16.2
NetU?#17_2: U?#17.2(~{OUT}) U?#18.1

Not connected (* = marked no-connect by the designer): *#1 15(~{Y}13) 16(~{Y}14) 17(~{Y}15) 20(D) 21(C) 22(B) 23(A); J? 15* 18* 34* 35* 37(MH1) 38(MH2); JP?#15 1 2 11 12 18; PICY 1(RA2) 2(RA3) 3(RA4/T0CKI) 9(RB3); PICZ 3(RA4/T0CKI) 9(RB3); U?#1 12(Y4) 14(Y3) 16(Y2) 18(Y1); U?#12 7(~{QH}) 10(SI)

### Library data of the parts
*#1 = DM74LS154N: 4-Line to 16-Line Decoder/Demultiplexer; Manufacturer: Fairchild Semiconductor; Class I: Logic; Note: Generic Simulation model provided.; Published: 15-Apr-2002; Datasheet: Latest Revision: Mar-1998; Package Reference: N24A; Publisher: Altium Limited; Class II: Decoder/Demultiplexer
*#2-*#8 R28#2-R28#4 U?#16 = res1: as R1#1 on sheet Sheet1; Published: 8-Jun-2000; Revision: July-2002: Re-released for DXP Platform.; Publisher: Altium Limited; Class II: Resistor
C1#2 C1#3 = Cap: Capacitor; Manufacturer: Generic Components; Class I: Passive; Published: 8-Jun-2000; Revision: July-2002: Re-released for DXP Platform.; Publisher: Altium Limited; Class II: Capacitor
C4#2 C4#3 C5#2 C5#3 = cap: as C1#1 on sheet Sheet1; Published: 8-Jun-2000; Revision: July-2002: Re-released for DXP Platform.; Publisher: Altium Limited; Class II: Capacitor
D?#1 D?#2 = 1N4001: 1.0 Ampere General Purpose Rectifier; Manufacturer: Fairchild Semiconductor; Revision 1: 11-July-2000: SIM Model Added.; Revision 2: July-2002: Re-released for DXP Platform.; Package Information: Latest Revision: Aug-1999; Class I: Discrete; Class II: Rectifier - Standard Recovery; Published: 8-Jun-2000; Datasheet: Latest Revision: 1998; Package Reference: DO-41; Publisher: Altium Limited
DS?#1 DS?#2 = LED2: Typical RED, GREEN, YELLOW, AMBER GaAs LED; Manufacturer: Generic Components; Class I: Optoelectronic; Published: 8-Jun-2000; Revision: July-2002: Re-released for DXP Platform.; Publisher: Altium Limited; Class II: LED
J? = Connector 36: Receptacle Header Assemby; Manufacturer: Generic Components; Package Information: Latest Revision: B; Positions: 36; Published: 15-Jun-2001; Revision: July-2002: Re-released for DXP Platform.; Datasheet: (1-Oct-1983); Package Reference: 178240; Publisher: Altium Limited; Class I: Connector; Orientation: Right Angle
JP?#2 = MHDR1X9: Header, 9-Pin; Manufacturer: Generic Components; Class I: Connector; Revision: July-2002: Re-released for DXP Platform.; Publisher: Altium Limited
JP?#3 = Header 3H: Header, 3-Pin,  Right Angle; Manufacturer: Generic Components; Class I: Connector; Revision: July-2002: Re-released for DXP Platform.; Publisher: Altium Limited
JP?#4 = MHDR1X4: Header, 4-Pin; Manufacturer: Generic Components; Class I: Connector; Revision: July-2002: Re-released for DXP Platform.; Publisher: Altium Limited
JP?#5 JP?#7 JP?#10 JP?#16 = MHDR1X8: Header, 8-Pin; Manufacturer: Generic Components; Class I: Connector; Revision: July-2002: Re-released for DXP Platform.; Publisher: Altium Limited
JP?#6 JP?#8 = MHDR1X3: Header, 3-Pin; Manufacturer: Generic Components; Class I: Connector; Revision: July-2002: Re-released for DXP Platform.; Publisher: Altium Limited
JP?#9 = MHDR1X7: Header, 7-Pin; Manufacturer: Generic Components; Class I: Connector; Revision: July-2002: Re-released for DXP Platform.; Publisher: Altium Limited
JP?#11-JP?#14 = MHDR1X6: as JP1 on sheet Sheet1; Revision: July-2002: Re-released for DXP Platform.; Publisher: Altium Limited
JP?#15 = Header 10X2A: Header, 10-Pin, Dual row; Manufacturer: Generic Components; Revision: July-2002: Re-released for DXP Platform.; Publisher: Altium Limited; Class I: Connector
PICY PICZ = PIC16C84-04/P: as U1 on sheet Sheet1; Published: 8-Jun-2000; Revision: July-2002: Re-released for DXP Platform.; Datasheet: 1997 Technical Library CD (1996); Package Reference: P18A; Publisher: Altium Limited; Class I: Microcontroller; Class II: 8-bit
Q5#1-Q5#4 Q?#3 Q?#5 Q?#9 Q?#11 Q?#13 Q?#18 Q?#20 Q?#22 Q?#26 R?#1-R?#5 U?#3-U?#9 U?#14 U?#15 U?#18 = RES1: Resistor; Manufacturer: Generic Components; Class I: Passive; Published: 8-Jun-2000; Revision: July-2002: Re-released for DXP Platform.; Publisher: Altium Limited; Class II: Resistor
Q?#2 Q?#4 Q?#6-Q?#8 Q?#10 Q?#12 Q?#14 Q?#17 Q?#21 Q?#23-Q?#25 = 2N3906: PNP General Purpose Amplifier; Manufacturer: Generic Components; Revision 1: 11-July-2000: SIM Model Added.; Revision 2: July-2002: Re-released for DXP Platform.; Class I: Discrete; Class II: BJT - Low Power; Published: 8-Jun-2000; Datasheet: Latest Revision: 1997; Package Reference: TO-92A; Publisher: Altium Limited
Q?#15 = MJE15030: as Q1#1 on sheet Sheet1; Published: 29-Sep-2000; Revision: July-2002: Re-released for DXP Platform.; Datasheet: Latest Revision: 1995; Package Reference: 221A-06; Publisher: Altium Limited
Q?#16 Q?#19 Q?#27 = 2N3904: NPN General Purpose Amplifier; Manufacturer: Generic Components; Revision 1: 11-July-2000: SIM Model Added.; Revision 2: July-2002: Re-released for DXP Platform.; Class I: Discrete; Class II: BJT - Low Power; Published: 8-Jun-2000; Datasheet: Latest Revision: 1997; Package Reference: TO-92A; Publisher: Altium Limited
Q?#28 = NPN: NPN Bipolar Transistor; Manufacturer: Generic Components; Class I: Discrete; Class II: BJT - Low Power; Published: 8-Jun-2000; Revision: July-2002: Re-released for DXP Platform.; Publisher: Altium Limited
U?#1 U?#2 U?#11 = SN74LS244N: Octal Buffer/Line Driver with 3-State Outputs; Manufacturer: ON Semiconductor; Class I: Logic; Published: 15-Apr-2002; Package Reference: 738-03; Publisher: Altium Limited; Class II: Buffer/Line Driver
U?#10 U?#13 U?#17 = SN74LS04N: as U9#1 on sheet Sheet1; Published: 15-Apr-2002; Datasheet: Latest Revision: 1999; Package Reference: 646-06; Publisher: Altium Limited
U?#12 = DM74LS165N: 8-Bit Parallel In/Serial Output Shift Register; Manufacturer: Fairchild Semiconductor; Package Information: Latest Revision: 2000; Class I: Logic; Note: Generic simulation model provided.; Published: 15-Apr-2002; Datasheet: Latest Revision: Apr-1998; Package Reference: W16A; Publisher: Altium Limited; Class II: Register
X1#2 X1#3 = XTAL: as X1#1 on sheet Sheet1; Published: 8-Jun-2000; Revision: July-2002: Re-released for DXP Platform.; Publisher: Altium Limited; Class I: Oscillator; Class II: Crystal Oscillator

## Sheet END EFFECTOR.SchDoc
size B
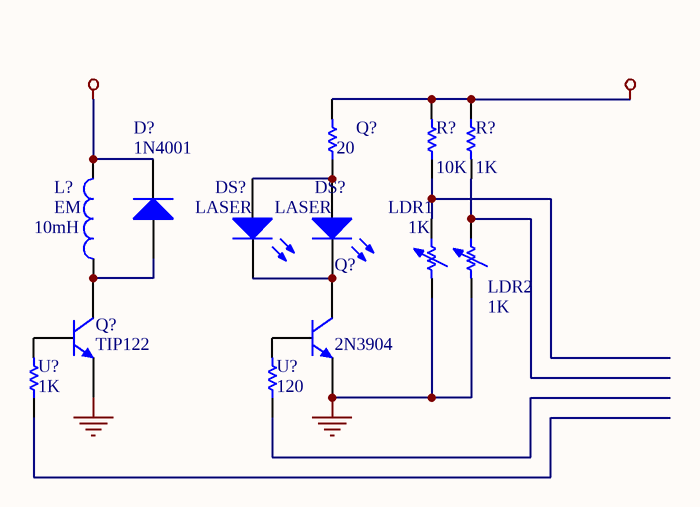
[diagram p3: END EFFECTOR.SchDoc]

### Parts
(Parts that share a designator on the sheet are numbered #1, #2 ... from top to bottom, then left to right.)
D?#3  1N4001  [DIO10.46-5.3x2.8]
DS?#3  LASER  [DSO-F2/D6.1]
DS?#4  LASER  [DSO-F2/D6.1]
L?  EM  value 10mH  [C1005-0402]
LDR1  value 1K  [AXIAL-0.7]  (hidden comment: Res Adj1)
LDR2  value 1K  [AXIAL-0.7]  (hidden comment: Res Adj1)
Q?#29  value 20  [BCY-W3/D4.7]  (hidden comment: 2N3904)
Q?#30  TIP122  [SFM-T3/X1.6V]
Q?#31  2N3904  [BCY-W3/D4.7]
R?#6  value 1K  [AXIAL-0.7]  (hidden comment: Res Adj1)
R?#7  value 10K  [AXIAL-0.7]  (hidden comment: Res Adj1)
U?#19  value 1K  [DIP-14/D19.7]  (hidden comment: SN74LS04N)
U?#20  value 120  [DIP-14/D19.7]  (hidden comment: SN74LS04N)

### Nets
+12V: D?#3.2(K) L?.2
GND: LDR1.1 LDR2.1 Q?#30.3(E) Q?#31.1(E)
VDD: Q?#29.2 R?#6.1 R?#7.2
NetD?#3_1: D?#3.1(A) L?.1 Q?#30.2(C)
NetDS?#3_1: DS?#3.1(A) DS?#4.1(A) Q?#29.1
NetDS?#3_2: DS?#3.2(K) DS?#4.2(K) Q?#31.3(C)
NetLDR1_2: LDR1.2 R?#7.1
NetLDR2_2: LDR2.2 R?#6.2
NetQ?#30_1: Q?#30.1(B) U?#19.2
NetQ?#31_2: Q?#31.2(B) U?#20.2

Not connected (* = marked no-connect by the designer): U?#19 1; U?#20 1

### Library data of the parts
D?#3 = 1N4001: as D?#1 on sheet MAIN; Published: 8-Jun-2000; Datasheet: Latest Revision: 1998; Package Reference: DO-41; Publisher: Altium Limited
DS?#3 DS?#4 = LED2: as DS?#1 on sheet MAIN; Published: 8-Jun-2000; Revision: July-2002: Re-released for DXP Platform.; Publisher: Altium Limited; Class II: LED
L? = Inductor: Manufacturer: Generic Components; Class I: Passive; Published: 8-Jun-2000; Revision: July-2002: Re-released for DXP Platform.; Publisher: Altium Limited; Class II: Inductor
LDR1 LDR2 = Res Adj1: Variable Resistor; Manufacturer: Generic Components; Class I: Passive; Set Position: 0.5; Published: 8-Jun-2000; Revision: July-2002: Re-released for DXP Platform.; Publisher: Altium Limited; Class II: Resistor
Q?#29 R?#6 R?#7 U?#19 U?#20 = RES1: as Q5#1 on sheet MAIN; Published: 8-Jun-2000; Revision: July-2002: Re-released for DXP Platform.; Publisher: Altium Limited; Class II: Resistor
Q?#30 = MJE15030: as Q1#1 on sheet Sheet1; Published: 29-Sep-2000; Revision: July-2002: Re-released for DXP Platform.; Datasheet: Latest Revision: 1995; Package Reference: 221A-06; Publisher: Altium Limited
Q?#31 = 2N3904: as Q?#16 on sheet MAIN; Published: 8-Jun-2000; Datasheet: Latest Revision: 1997; Package Reference: TO-92A; Publisher: Altium Limited

## Nets that join several sheets
+12V: Sheet1 (B1A#1.3 B1B#1.3 JP1.1 R2#1.2), Driver3 (B1A#2.3 B1B#2.3 JP?#1.6 R2#2.2), MAIN (6 pins), END EFFECTOR (D?#3.2 L?.2)
GND: Sheet1 (17 pins), Driver3 (12 pins), MAIN (62 pins), END EFFECTOR (LDR1.1 LDR2.1 Q?#30.3 Q?#31.1)
VCC: Sheet1 (U7#1.16 U11#1.14 U14#1.14), Driver3 (U7#2.16 U11#2.14 U14#2.14)
VDD: Sheet1 (11 pins), Driver3 (7 pins), MAIN (45 pins), END EFFECTOR (Q?#29.2 R?#6.1 R?#7.2)
Coil OFF: Sheet1 (U1.12 U14#1.1), Driver3 (JP?#1.4 U14#2.1)